# Altium project switch.PrjPcb
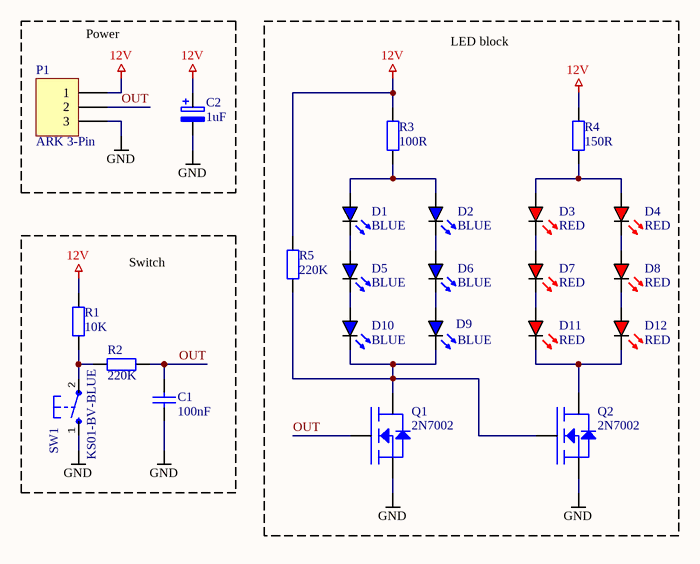
[diagram p0: switch.SchDoc]
1 sheet, 23 parts. Net scope: global (net labels, ports and power ports of the same name join across sheets).
Board file: switch.PcbDoc

## Sheet switch.SchDoc
size A4

### Parts
C1  100nF  [C0805]
C2  1uF  [TANC_A]
D1  BLUE  [LED0805]
D2  BLUE  [LED0805]
D3  RED  [LED0805]
D4  RED  [LED0805]
D5  BLUE  [LED0805]
D6  BLUE  [LED0805]
D7  RED  [LED0805]
D8  RED  [LED0805]
D9  BLUE  [LED0805]
D10  BLUE  [LED0805]
D11  RED  [LED0805]
D12  RED  [LED0805]
P1  ARK 3-Pin  [ARK-3.5mm-3pin]
Q1  2N7002  [SOT23]
Q2  2N7002  [SOT23]
R1  10K  [R0805]
R2  220K  [R0805]
R3  100R  [R0805]
R4  150R  [R0805]
R5  220K  [R0805]
SW1  KS01-BV-BLUE  [KS01-B]

### Blocks framed on the sheet
Power: C2 P1
LED block: D1-D12 Q1 Q2 R3-R5
Switch: C1 R1 R2 SW1

### Nets
12V: C2.1 P1.1 R1.2 R3.2 R4.2 R5.2
GND: C1.2 C2.2 P1.3 Q1.2(S) Q2.2(S) SW1.1(S)
OUT: C1.1 P1.2 Q1.1(G) R2.2
NetD1_1: D1.1 D5.2
NetD1_2: D1.2 D2.2 R3.1
NetD2_1: D2.1 D6.2
NetD3_1: D3.1 D7.2
NetD3_2: D3.2 D4.2 R4.1
NetD4_1: D4.1 D8.2
NetD5_1: D5.1 D10.2
NetD6_1: D6.1 D9.2
NetD7_1: D7.1 D11.2
NetD8_1: D8.1 D12.2
NetD9_1: D9.1 D10.1 Q1.3(D) Q2.1(G) R5.1
NetD11_1: D11.1 D12.1 Q2.3(D)
NetR1_1: R1.1 R2.1 SW1.2(P)

### Library data of the parts
C1 = Cap: Capacitor
C2 = Cap_Pol: Capacitor Polarized
D1 D2 D5 D6 D9 D10 = LED_BLUE: LED
D3 D4 D7 D8 D11 D12 = LED_RED: LED
Q1 Q2 = 2N7002(GSD): N-MOSFET
R1-R5 = Res: Resistor
SW1 = KS01: Pozycje:2; SPST-NO; 0,01A/35VDC; 1,3N